# EAGLE design Adapter IC LTC (EAGLE 9.6.2)
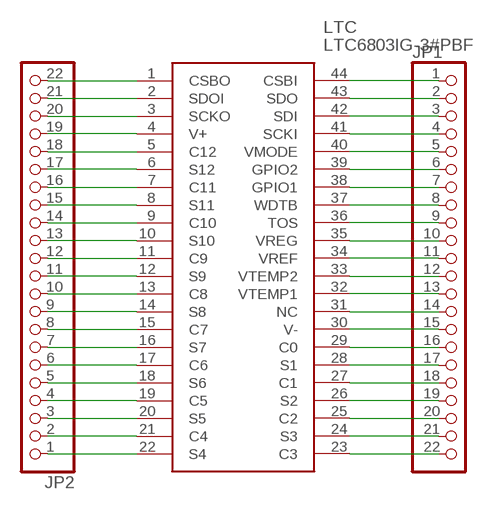
[diagram p0: schematic, sheet 1]

## Parts
JP1  PINHD-1X22  [1X22]
JP2  PINHD-1X22  [1X22]
LTC  LTC6803IG-3#PBF  [SOP50P780X185-44N]

## Nets
N$1: JP2.22 LTC.1(CSBO)
N$2: JP2.21 LTC.2(SDOI)
N$3: JP2.20 LTC.3(SCKO)
N$4: JP2.19 LTC.4(V+)
N$5: JP2.18 LTC.5(C12)
N$6: JP2.17 LTC.6(S12)
N$7: JP2.16 LTC.7(C11)
N$8: JP2.15 LTC.8(S11)
N$9: JP2.14 LTC.9(C10)
N$10: JP2.13 LTC.10(S10)
N$11: JP2.12 LTC.11(C9)
N$12: JP2.11 LTC.12(S9)
N$13: JP2.10 LTC.13(C8)
N$14: JP2.9 LTC.14(S8)
N$15: JP2.8 LTC.15(C7)
N$16: JP2.7 LTC.16(S7)
N$17: JP2.6 LTC.17(C6)
N$18: JP2.5 LTC.18(S6)
N$19: JP2.4 LTC.19(C5)
N$20: JP2.3 LTC.20(S5)
N$21: JP2.2 LTC.21(C4)
N$22: JP2.1 LTC.22(S4)
N$23: JP1.22 LTC.23(C3)
N$24: JP1.21 LTC.24(S3)
N$25: JP1.20 LTC.25(C2)
N$26: JP1.19 LTC.26(S2)
N$27: JP1.18 LTC.27(C1)
N$28: JP1.17 LTC.28(S1)
N$29: JP1.16 LTC.29(C0)
N$30: JP1.15 LTC.30(V-)
N$31: JP1.14 LTC.31(NC)
N$32: JP1.13 LTC.32(VTEMP1)
N$33: JP1.12 LTC.33(VTEMP2)
N$34: JP1.11 LTC.34(VREF)
N$35: JP1.10 LTC.35(VREG)
N$36: JP1.9 LTC.36(TOS)
N$37: JP1.7 LTC.38(GPIO1)
N$38: JP1.8 LTC.37(WDTB)
N$39: JP1.6 LTC.39(GPIO2)
N$40: JP1.5 LTC.40(VMODE)
N$41: JP1.4 LTC.41(SCKI)
N$42: JP1.3 LTC.42(SDI)
N$43: JP1.2 LTC.43(SDO)
N$44: JP1.1 LTC.44(CSBI)

## Library data of the parts
JP1 JP2 = pinhead:PINHD-1X22: PIN HEADER
LTC = LTC6803IG-3#PBF:LTC6803IG-3#PBF: Multicell Battery Stack Monitor Linear Technology LTC6803IG-3#PBF, Battery Charge Controller, 1.6mA, 44-Pin SSOP Source: Datasheet <http://cds.linear.com/docs/en/datasheet/680313fa.pdf>; ARROW_PART_NUMBER: LTC6803IG-3#PBF; ARROW_PRICE-STOCK: https://www.arrow.com/en/products/ltc6803ig-3pbf/linear-technology; DESCRIPTION: Multicell Battery Stack Monitor Linear Technology LTC6803IG-3#PBF, Battery Charge Controller, 1.6mA, 44-Pin SSOP; HEIGHT: 1.85mm; MANUFACTURER_NAME: Linear Technology; MANUFACTURER_PART_NUMBER: LTC6803IG-3#PBF; MOUSER_PART_NUMBER: 584-LTC6803IG-3#PBF; MOUSER_PRICE-STOCK: https://www.mouser.co.uk/ProductDetail/Analog-Devices-Linear-Technology/LTC6803IG-3PBF?qs=hVkxg5c3xu8Q%2FSc4ePVcZg%3D%3D

## Net classes
0 default: clearance 0.205 mm

## Board
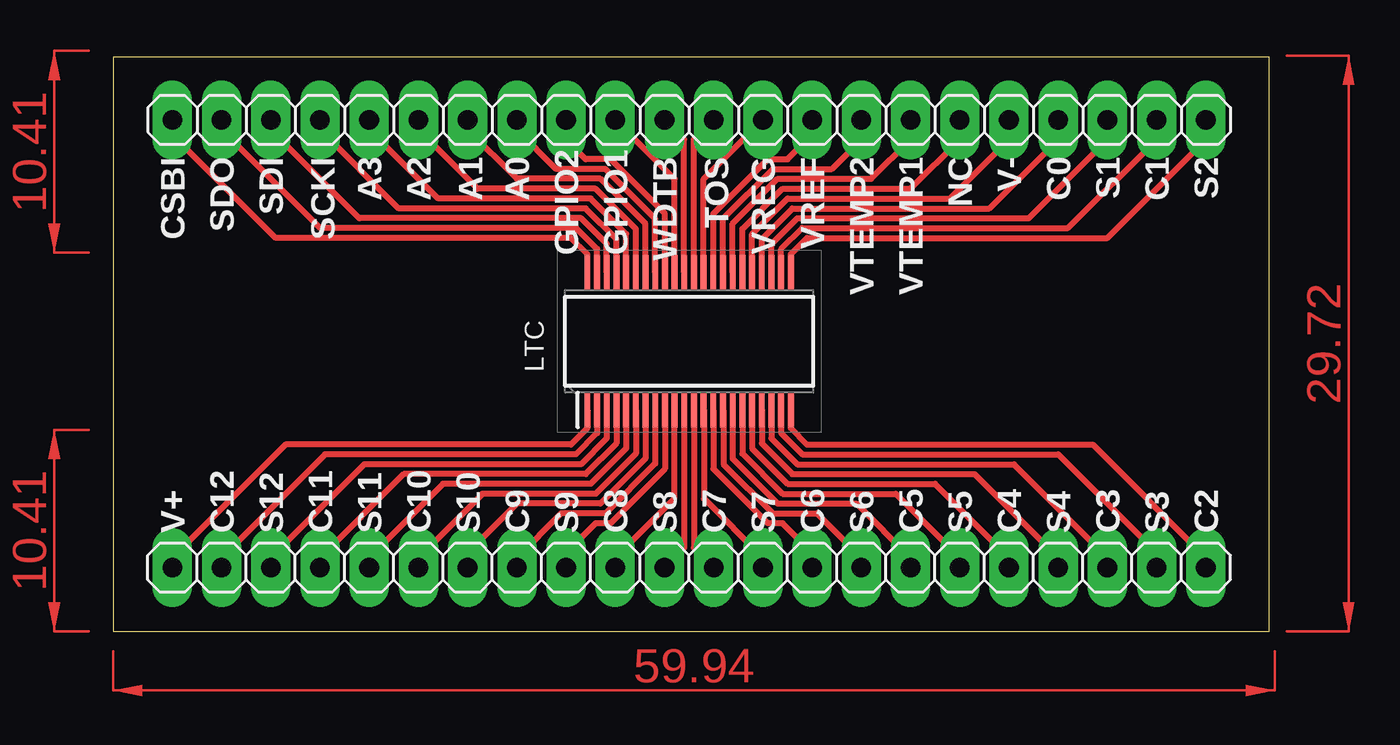
[diagram p1: board, top side]

Size 59.67 x 29.64 mm. Coordinates in mm from the lower left corner, seen from the top.
Outline: 0,0 59.67,0 59.67,29.64 0,29.64 0,0
Copper layers (1*16): Top 0.035mm / dielectric 1.5mm / Bottom 0.035mm
Design rules "default *": minimum track width 6mil, minimum drill 0.35mm, track to track 6mil, track to pad 6mil, pad to pad 6mil, via to via 6mil, smd to smd 6mil, copper to edge 40mil, drill to drill 6mil, minimum pad ring 10mil, minimum via ring 8mil, stop-mask expansion 4mil, vias tented up to drill 0mil, thermal gap 10mil

### Footprints (pad centres in the part's own frame; a part is rotated, then mirrored left to right if it is on the bottom)
1X22 = drill 1.016 long: 1 -26.67,0; 2 -24.13,0; 3 -21.59,0; 4 -19.05,0; 5 -16.51,0; 6 -13.97,0; 7 -11.43,0; 8 -8.89,0; 9 -6.35,0; 10 -3.81,0; 11 -1.27,0; 12 1.27,0; 13 3.81,0; 14 6.35,0; 15 8.89,0; 16 11.43,0; 17 13.97,0; 18 16.51,0; 19 19.05,0; 20 21.59,0; 21 24.13,0; 22 26.67,0
SOP50P780X185-44N = smd 1.8 x 0.3: 1 -3.55,5.25; 2 -3.55,4.75; 3 -3.55,4.25; 4 -3.55,3.75; 5 -3.55,3.25; 6 -3.55,2.75; 7 -3.55,2.25; 8 -3.55,1.75; 9 -3.55,1.25; 10 -3.55,0.75; 11 -3.55,0.25; 12 -3.55,-0.25; 13 -3.55,-0.75; 14 -3.55,-1.25; 15 -3.55,-1.75; 16 -3.55,-2.25; 17 -3.55,-2.75; 18 -3.55,-3.25; 19 -3.55,-3.75; 20 -3.55,-4.25; 21 -3.55,-4.75; 22 -3.55,-5.25; 23 3.55,-5.25; 24 3.55,-4.75; 25 3.55,-4.25; 26 3.55,-3.75; 27 3.55,-3.25; 28 3.55,-2.75; 29 3.55,-2.25; 30 3.55,-1.75; 31 3.55,-1.25; 32 3.55,-0.75; 33 3.55,-0.25; 34 3.55,0.25; 35 3.55,0.75; 36 3.55,1.25; 37 3.55,1.75; 38 3.55,2.25; 39 3.55,2.75; 40 3.55,3.25; 41 3.55,3.75; 42 3.55,4.25; 43 3.55,4.75; 44 3.55,5.25

### Placement (x,y rotation side)
JP1  29.72,26.42 0 top
JP2  29.72,3.3 180 top
LTC  29.72,14.99 90 top

### Tracks (layer width: path | path; a pad name or v marks a point on that pad's centre or on a via)
N$1
  Top 0.305: LTC.1 24.47,10.5 23.62,9.65 8.89,9.65 3.05,3.81 JP2.22
N$2
  Top 0.305: LTC.2 24.97,10.24 23.88,9.14 10.92,9.14 5.59,3.81 JP2.21
N$3
  Top 0.305: LTC.3 25.47,9.97 24.13,8.64 12.95,8.64 8.13,3.81 JP2.20
N$4
  Top 0.305: LTC.4 25.97,9.71 24.38,8.13 14.99,8.13 10.67,3.81 JP2.19
N$5
  Top 0.305: LTC.5 26.47,9.45 24.64,7.62 17.02,7.62 13.21,3.81 JP2.18
N$6
  Top 0.305: LTC.6 26.97,9.19 24.89,7.11 19.05,7.11 15.75,3.81 JP2.17
N$7
  Top 0.305: LTC.7 27.47,8.93 25.15,6.6 20.83,6.6 18.29,4.06 JP2.16
N$8
  Top 0.305: LTC.8 27.97,8.66 25.4,6.1 23.11,6.1 20.83,3.81 JP2.15
N$9
  Top 0.305: LTC.9 28.47,8.4 25.65,5.59 24.89,5.59 23.37,4.06 JP2.14
N$10
  Top 0.305: JP2.13 25.91,3.81 28.96,6.86 28.96,11.42 LTC.10
N$11
  Top 0.305: LTC.11 29.47,4.32 JP2.12
N$12
  Top 0.305: LTC.12 29.97,4.32 JP2.11
N$13
  Top 0.305: LTC.13 30.48,11.42 30.48,6.86 33.53,3.81 JP2.10
N$14
  Top 0.305: LTC.14 30.97,8.4 33.78,5.59 34.54,5.59 36.07,4.06 JP2.9
N$15
  Top 0.305: LTC.15 31.5,11.41 31.5,8.64 34.04,6.1 36.32,6.1 38.61,3.81 JP2.8
N$16
  Top 0.305: LTC.16 31.97,8.93 34.29,6.6 38.35,6.6 41.15,3.81 JP2.7
N$17
  Top 0.305: LTC.17 32.47,9.19 34.54,7.11 40.39,7.11 43.69,3.81 JP2.6
N$18
  Top 0.305: LTC.18 32.97,9.45 34.8,7.62 42.42,7.62 46.23,3.81 JP2.5
N$19
  Top 0.305: LTC.19 33.47,9.71 35.05,8.13 44.45,8.13 48.77,3.81 JP2.4
N$20
  Top 0.305: LTC.20 33.97,9.97 35.31,8.64 46.48,8.64 51.31,3.81 JP2.3
N$21
  Top 0.305: LTC.21 34.47,10.24 35.56,9.14 48.77,9.14 53.85,4.06 JP2.2
N$22
  Top 0.305: LTC.22 34.97,10.5 35.81,9.65 50.55,9.65 56.39,3.81 JP2.1
N$23
  Top 0.305: LTC.23 34.97,19.47 35.81,20.32 51.31,20.32 56.39,25.4 JP1.22
N$24
  Top 0.305: LTC.24 34.47,19.74 35.56,20.83 49.28,20.83 53.85,25.4 JP1.21
N$25
  Top 0.305: LTC.25 33.97,20 35.31,21.34 47.24,21.34 51.31,25.4 JP1.20
N$26
  Top 0.305: LTC.26 33.47,20.26 35.05,21.84 45.21,21.84 48.77,25.4 JP1.19
N$27
  Top 0.305: LTC.27 32.97,20.52 34.8,22.35 43.18,22.35 46.23,25.4 JP1.18
N$28
  Top 0.305: LTC.28 32.47,20.78 34.54,22.86 41.15,22.86 43.69,25.4 JP1.17
N$29
  Top 0.305: LTC.29 31.97,21.05 34.29,23.37 39.12,23.37 41.15,25.4 JP1.16
N$30
  Top 0.305: LTC.30 31.47,21.31 34.04,23.88 37.08,23.88 38.61,25.4 JP1.15
N$31
  Top 0.305: LTC.31 30.97,21.57 33.78,24.38 34.8,24.38 36.07,25.65 JP1.14
N$32
  Top 0.305: LTC.32 30.47,23.36 JP1.13
N$33
  Top 0.305: LTC.33 29.97,25.4 JP1.12
N$34
  Top 0.305: JP1.11 29.47,25.4 LTC.34
N$35
  Top 0.305: LTC.35 28.97,23.36 JP1.10
N$36
  Top 0.305: LTC.36 28.47,21.57 25.65,24.38 24.38,24.38 23.37,25.4 JP1.9
N$37
  Top 0.305: LTC.38 27.47,21.05 25.15,23.37 20.83,23.37 18.29,25.91 JP1.7
N$38
  Top 0.305: LTC.37 27.97,21.31 25.4,23.88 22.86,23.88 20.83,25.91 JP1.8
N$39
  Top 0.305: LTC.39 26.97,20.78 24.89,22.86 18.8,22.86 15.75,25.91 JP1.6
N$40
  Top 0.305: LTC.40 26.47,20.52 24.64,22.35 16.76,22.35 13.21,25.91 JP1.5
N$41
  Top 0.305: LTC.41 25.97,20.26 24.38,21.84 14.73,21.84 10.67,25.91 JP1.4
N$42
  Top 0.305: LTC.42 25.47,20.02 24.15,21.34 12.7,21.34 8.13,25.91 JP1.3
N$43
  Top 0.305: LTC.43 24.97,19.75 23.89,20.83 10.67,20.83 5.59,25.91 JP1.2
N$44
  Top 0.305: LTC.44 24.47,19.47 23.62,20.32 8.38,20.32 3.05,25.65 JP1.1
(copper drawn outside any net)
  shapes: Top area x4

### Text on the board
tNames: CSBI | SDO | SDI | SCKI | A3 | A2 | A1 | A0 | GPIO2 | GPIO1 | WDTB | TOS | VREG | VREF | VTEMP2 | VTEMP1 | NC | V- | C0 | S1 | C1 | S2 | V+ | C12 | S12 | C11 | S11 | C10 | S10 | C9 | S9 | C8 | S8 | C7 | S7 | C6 | S6 | C5 | S5 | C4 | S4 | C3 | S3 | C2